# EasyEDA schematic ECUs.json

## Sheets
1 power: TITLE: Power; REV: 1.0; Date: 2020-06-11; Sheet: 1/1; Company: Your Company
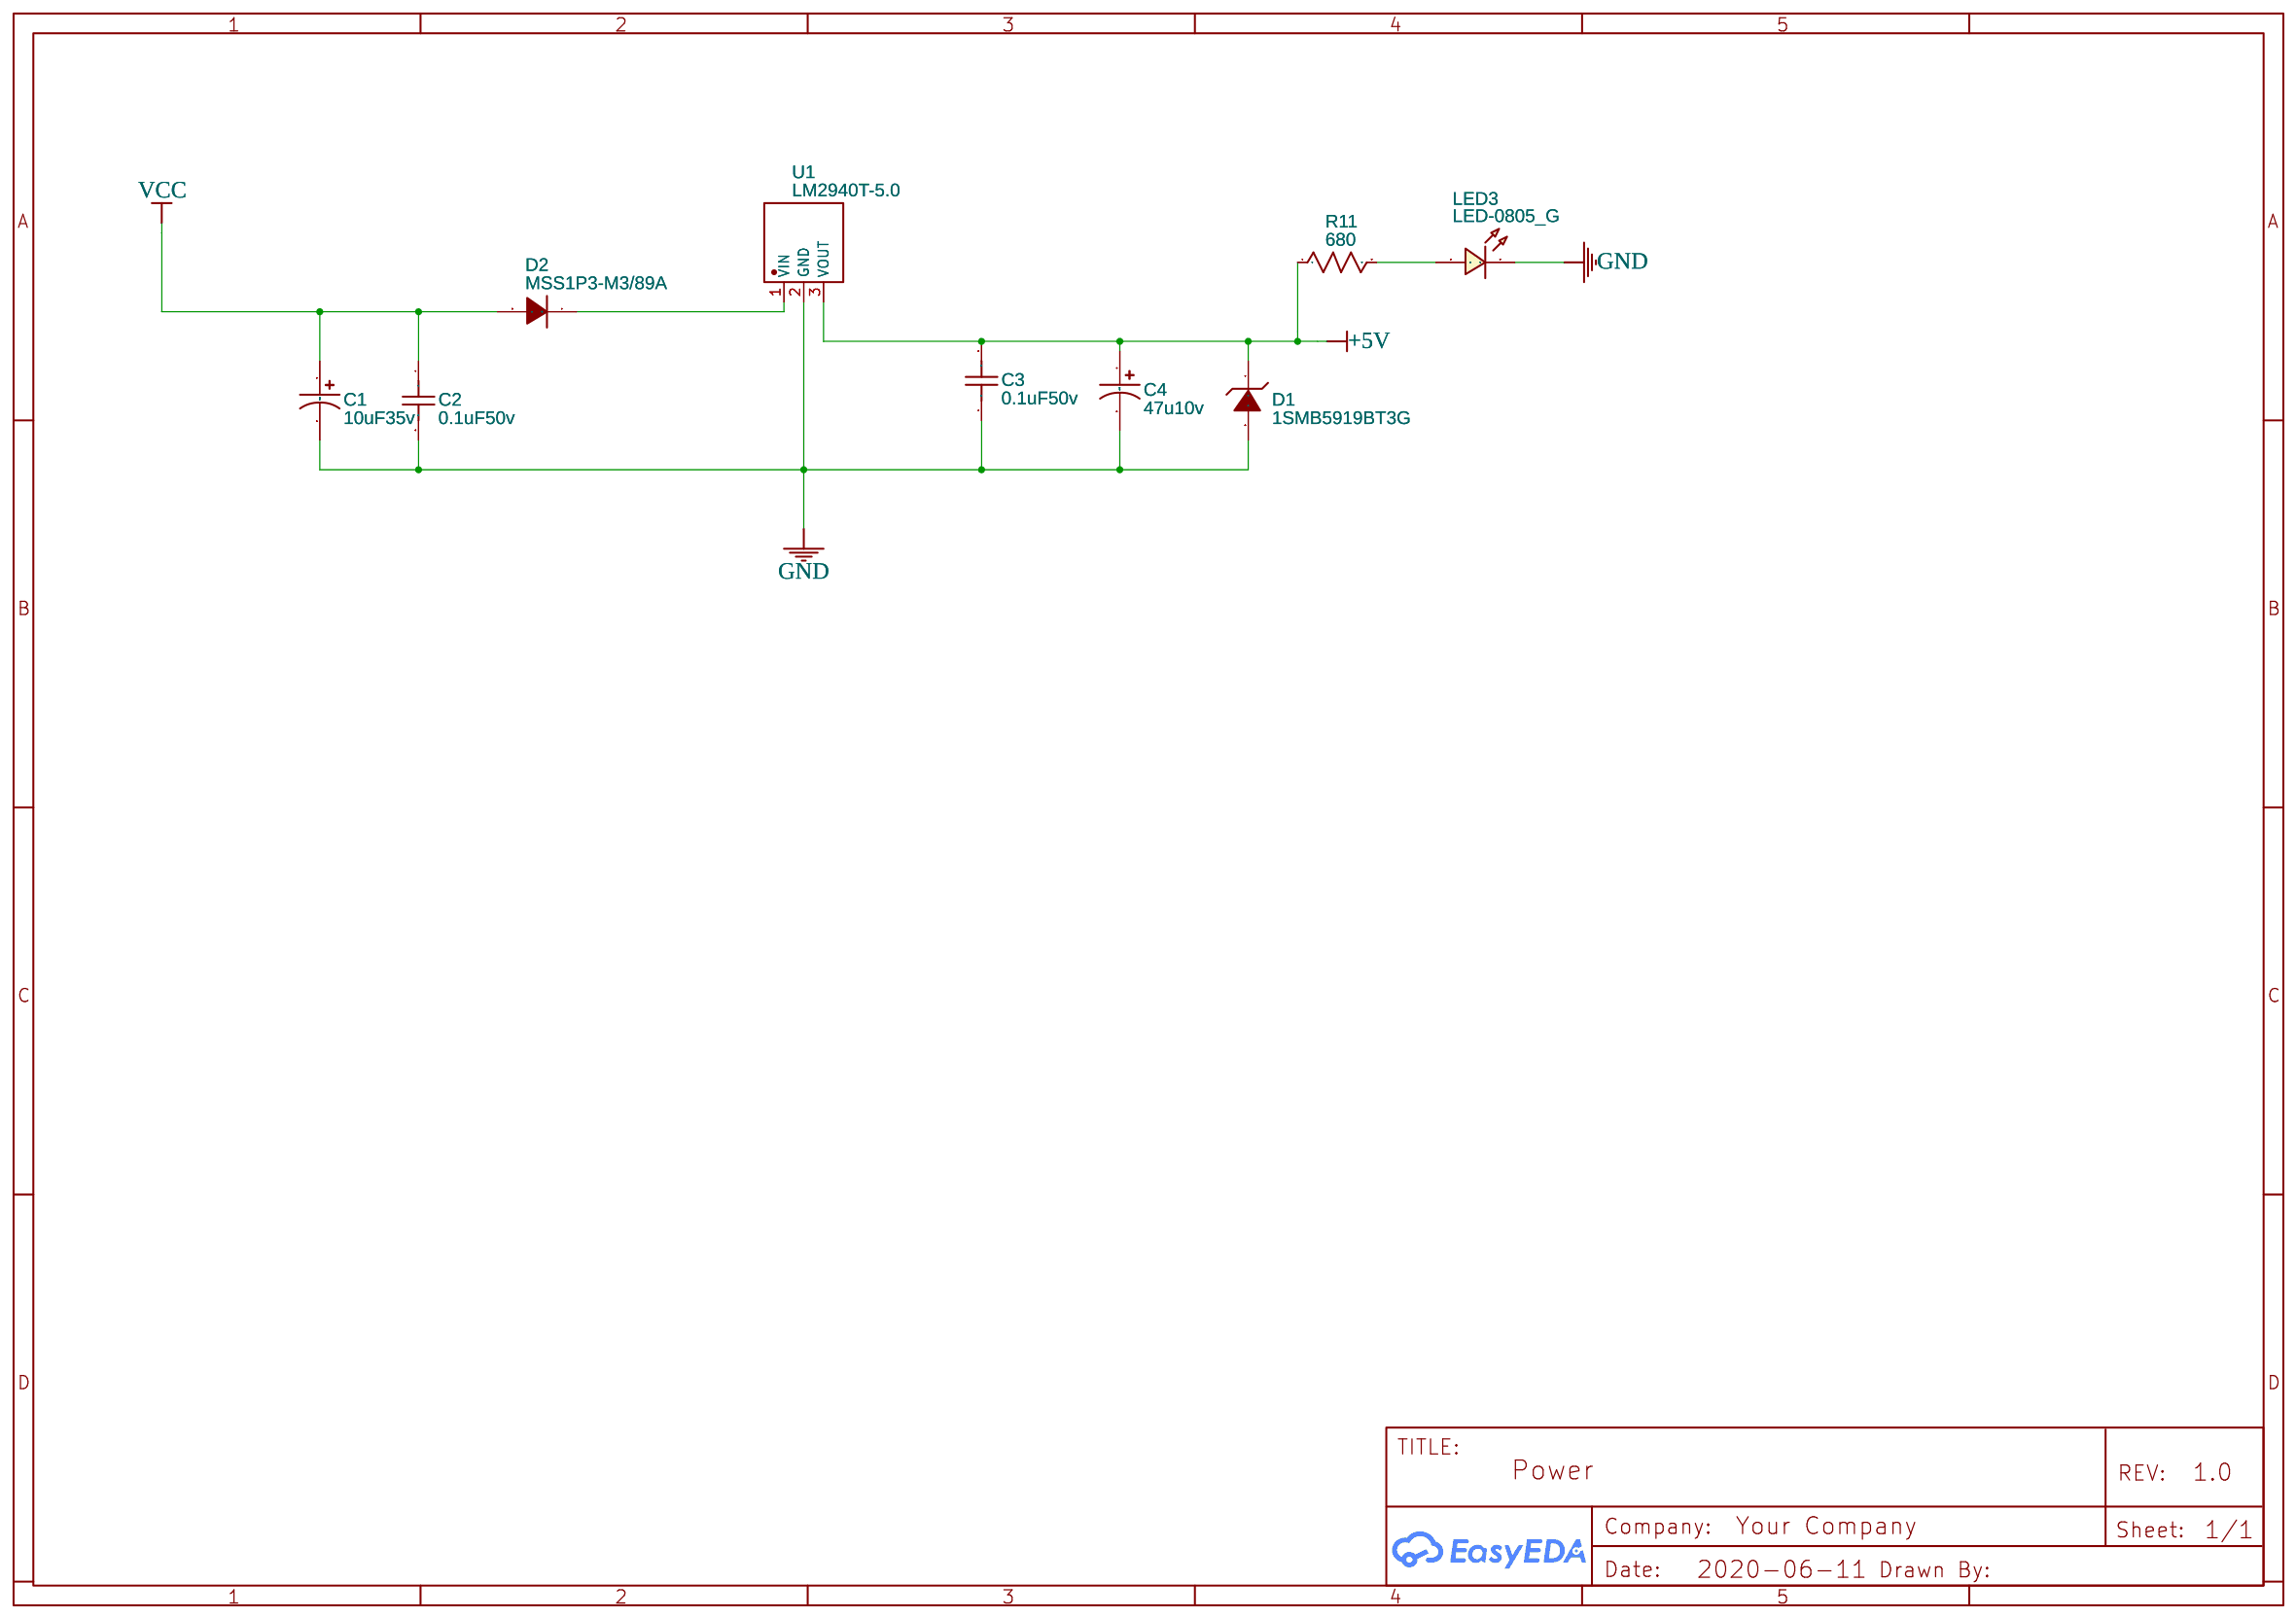
[diagram p0: power]
2 INJ: TITLE: injector
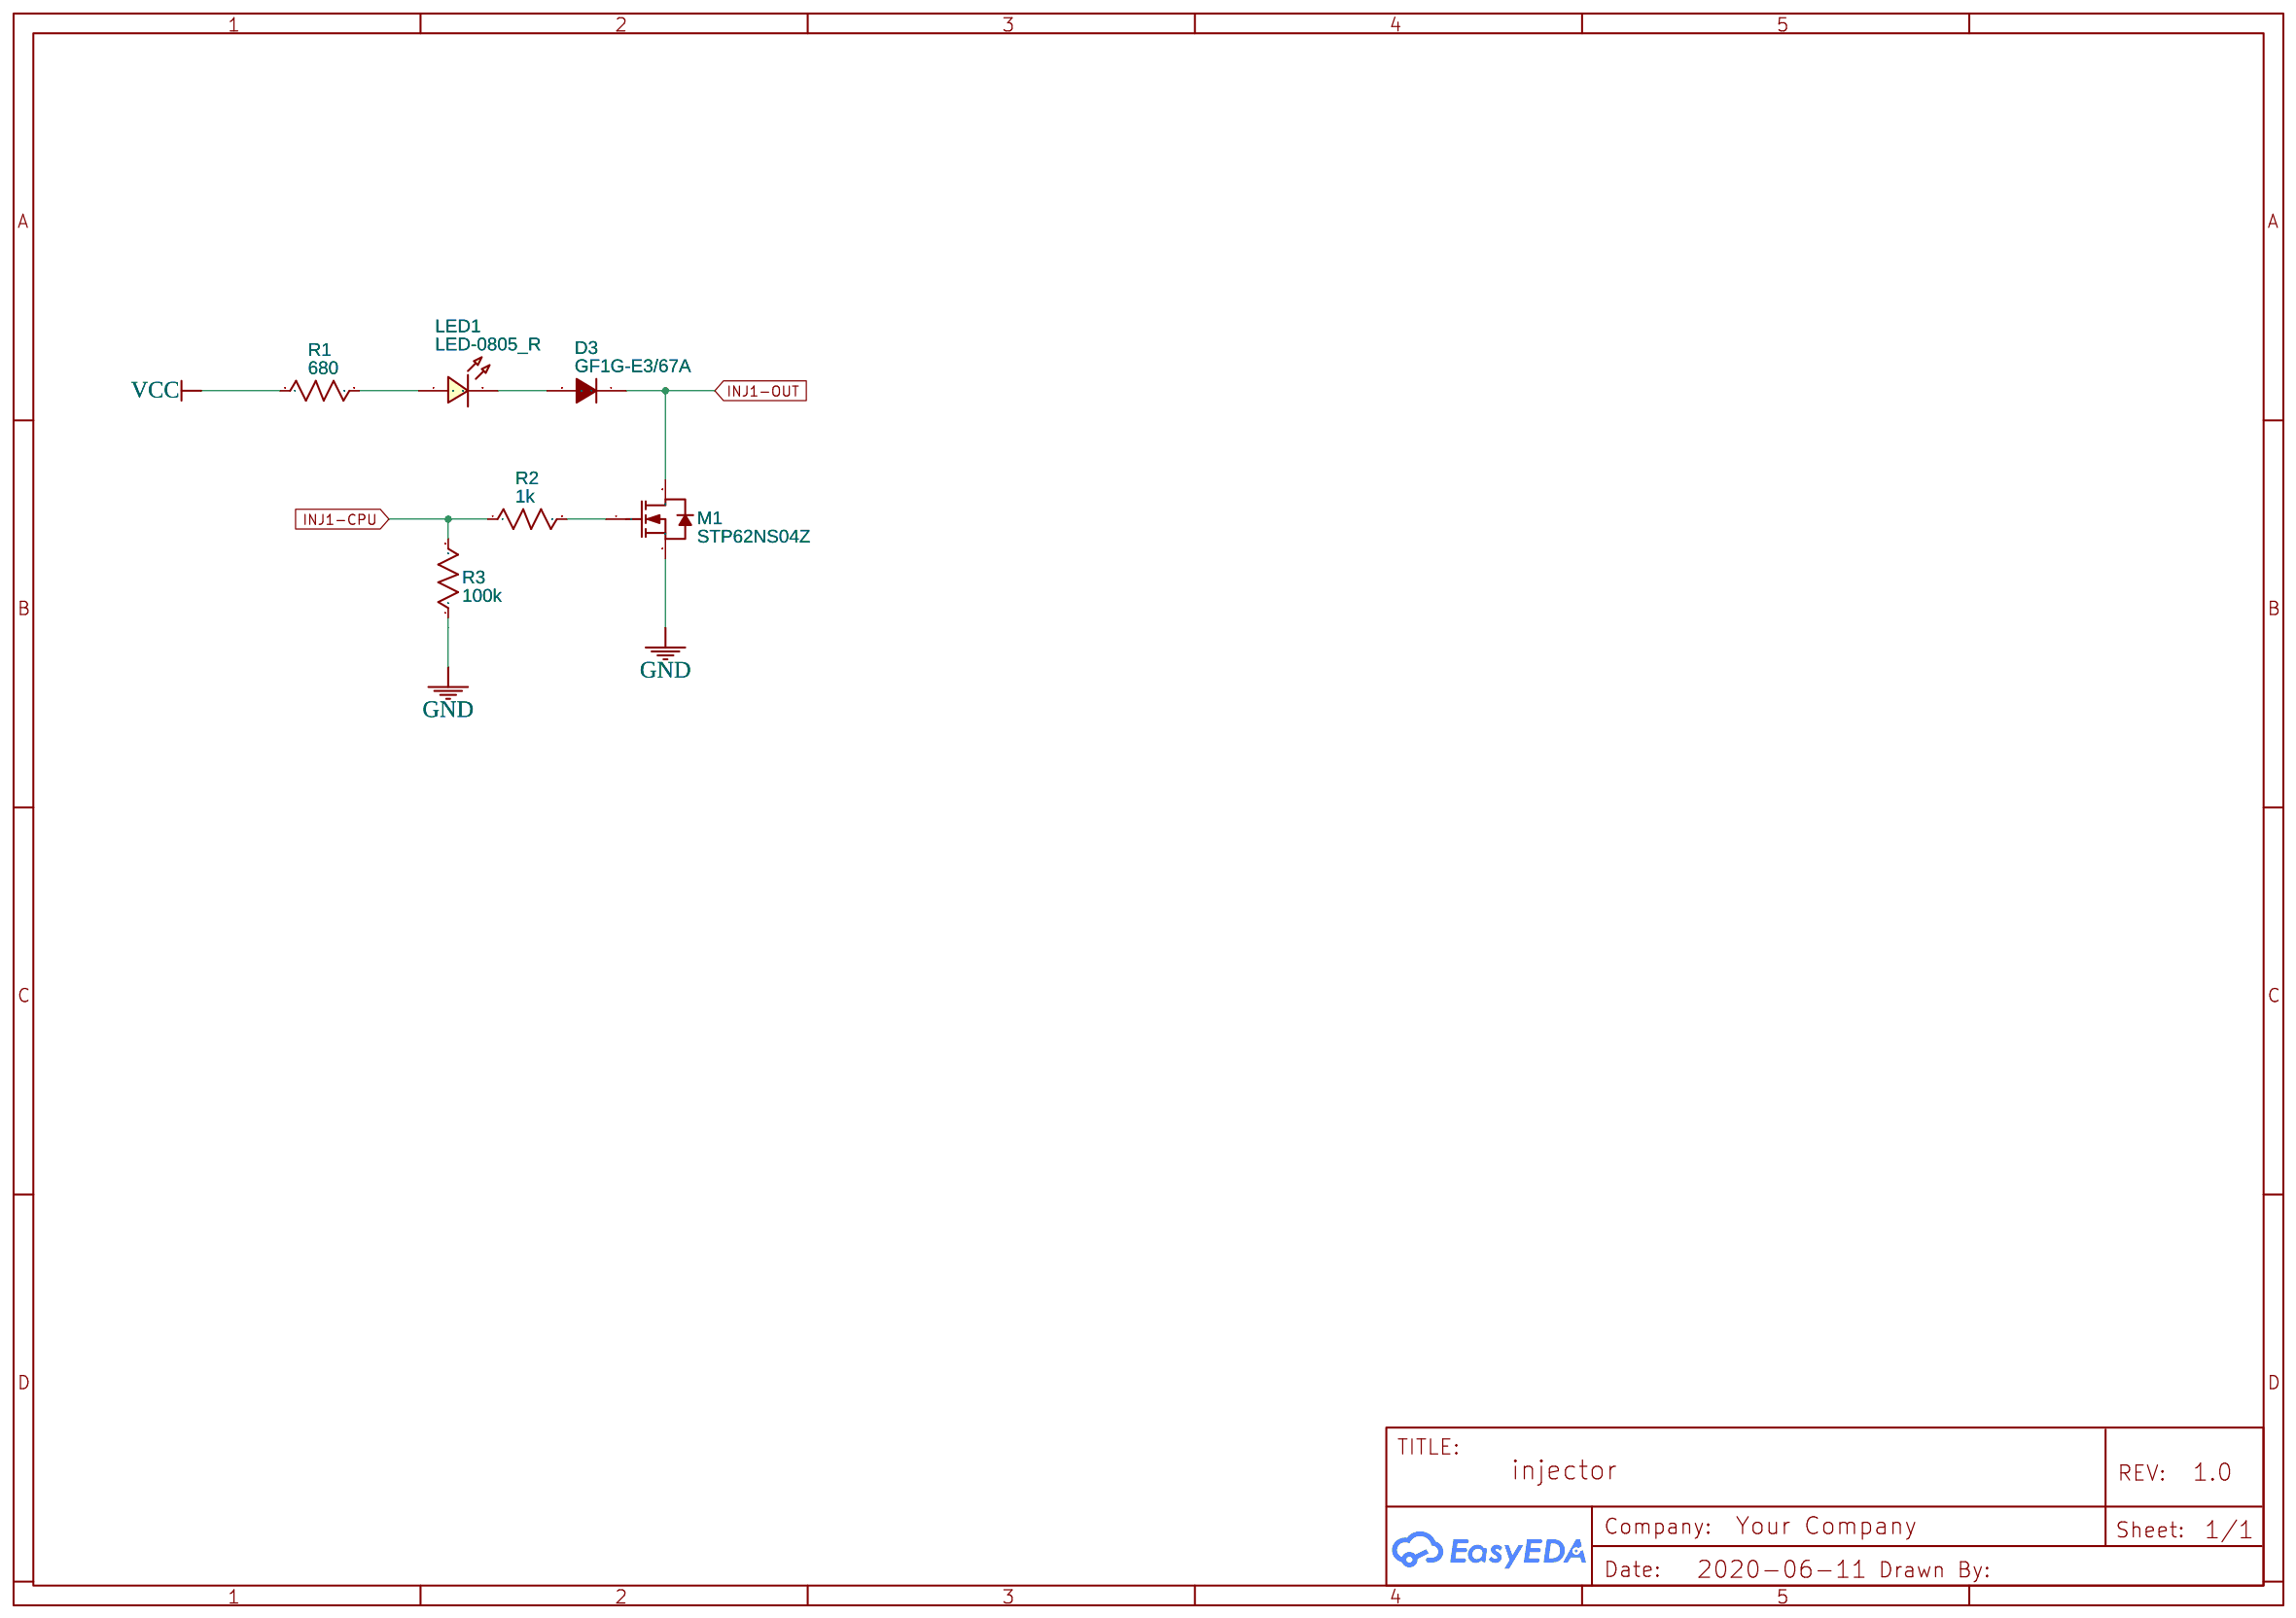
[diagram p1: INJ]
3 plug: TITLE: injector
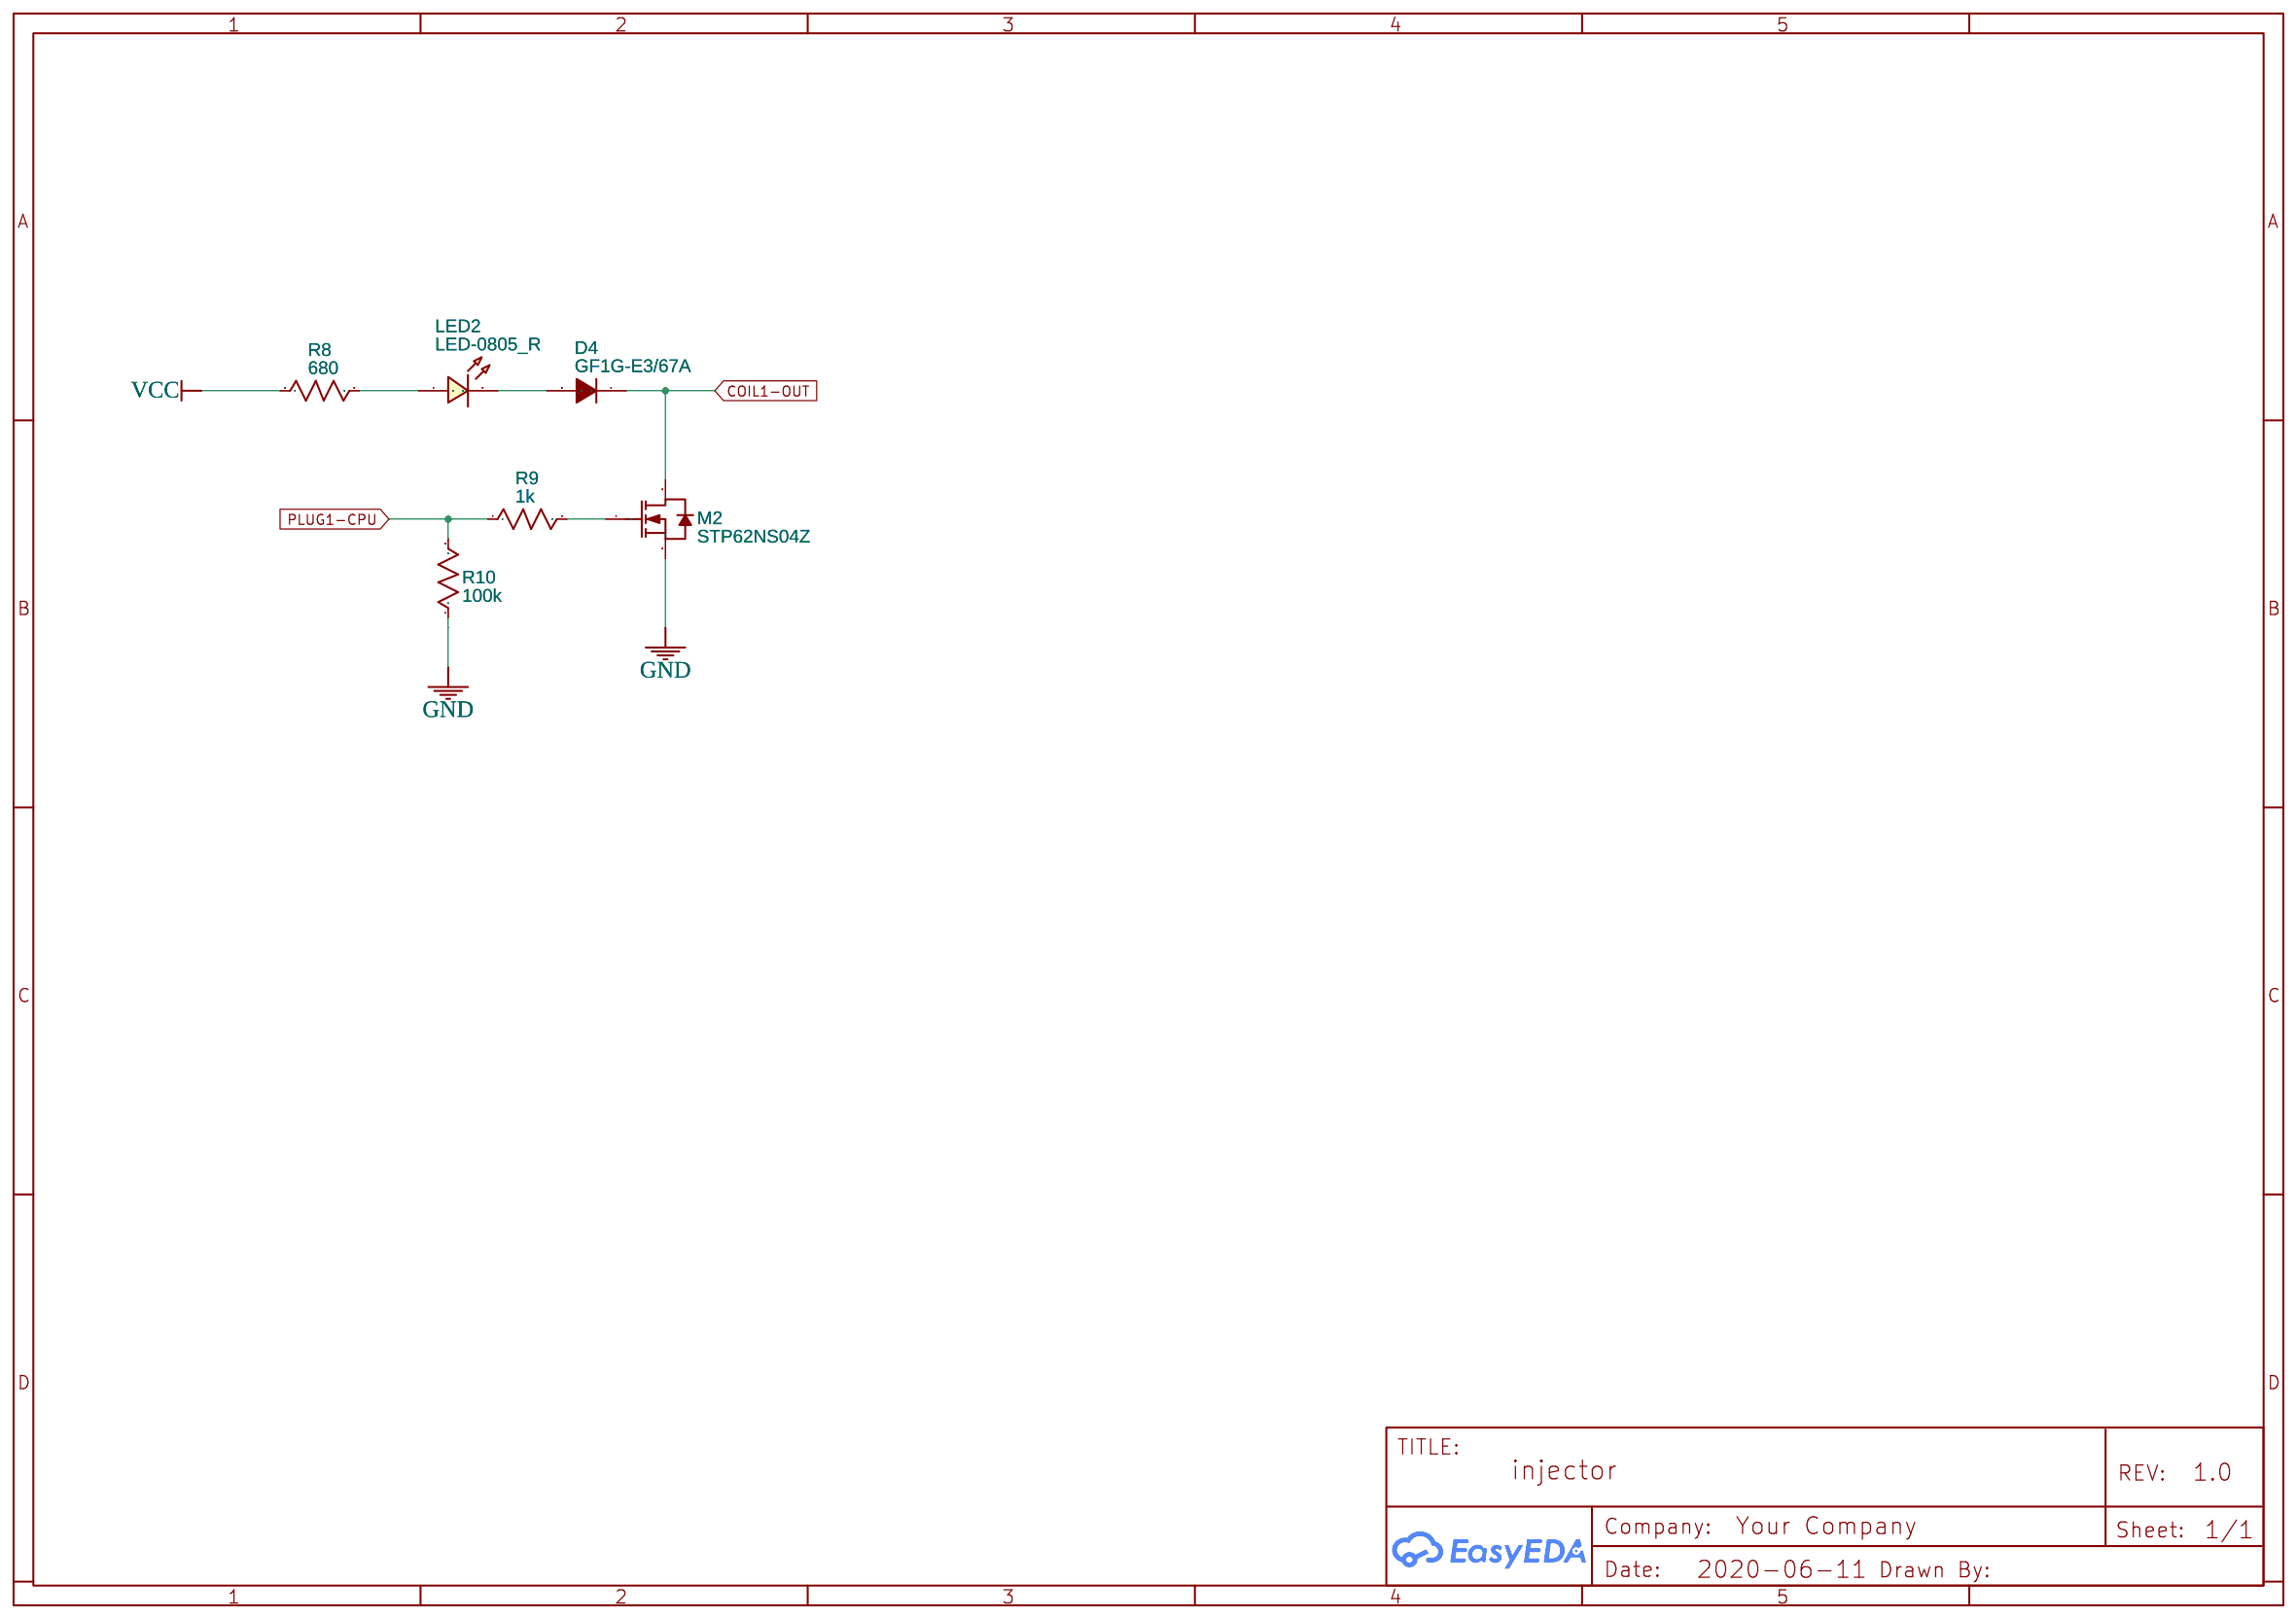
[diagram p2: plug]
4 Batt: TITLE: Battery Reference Voltage
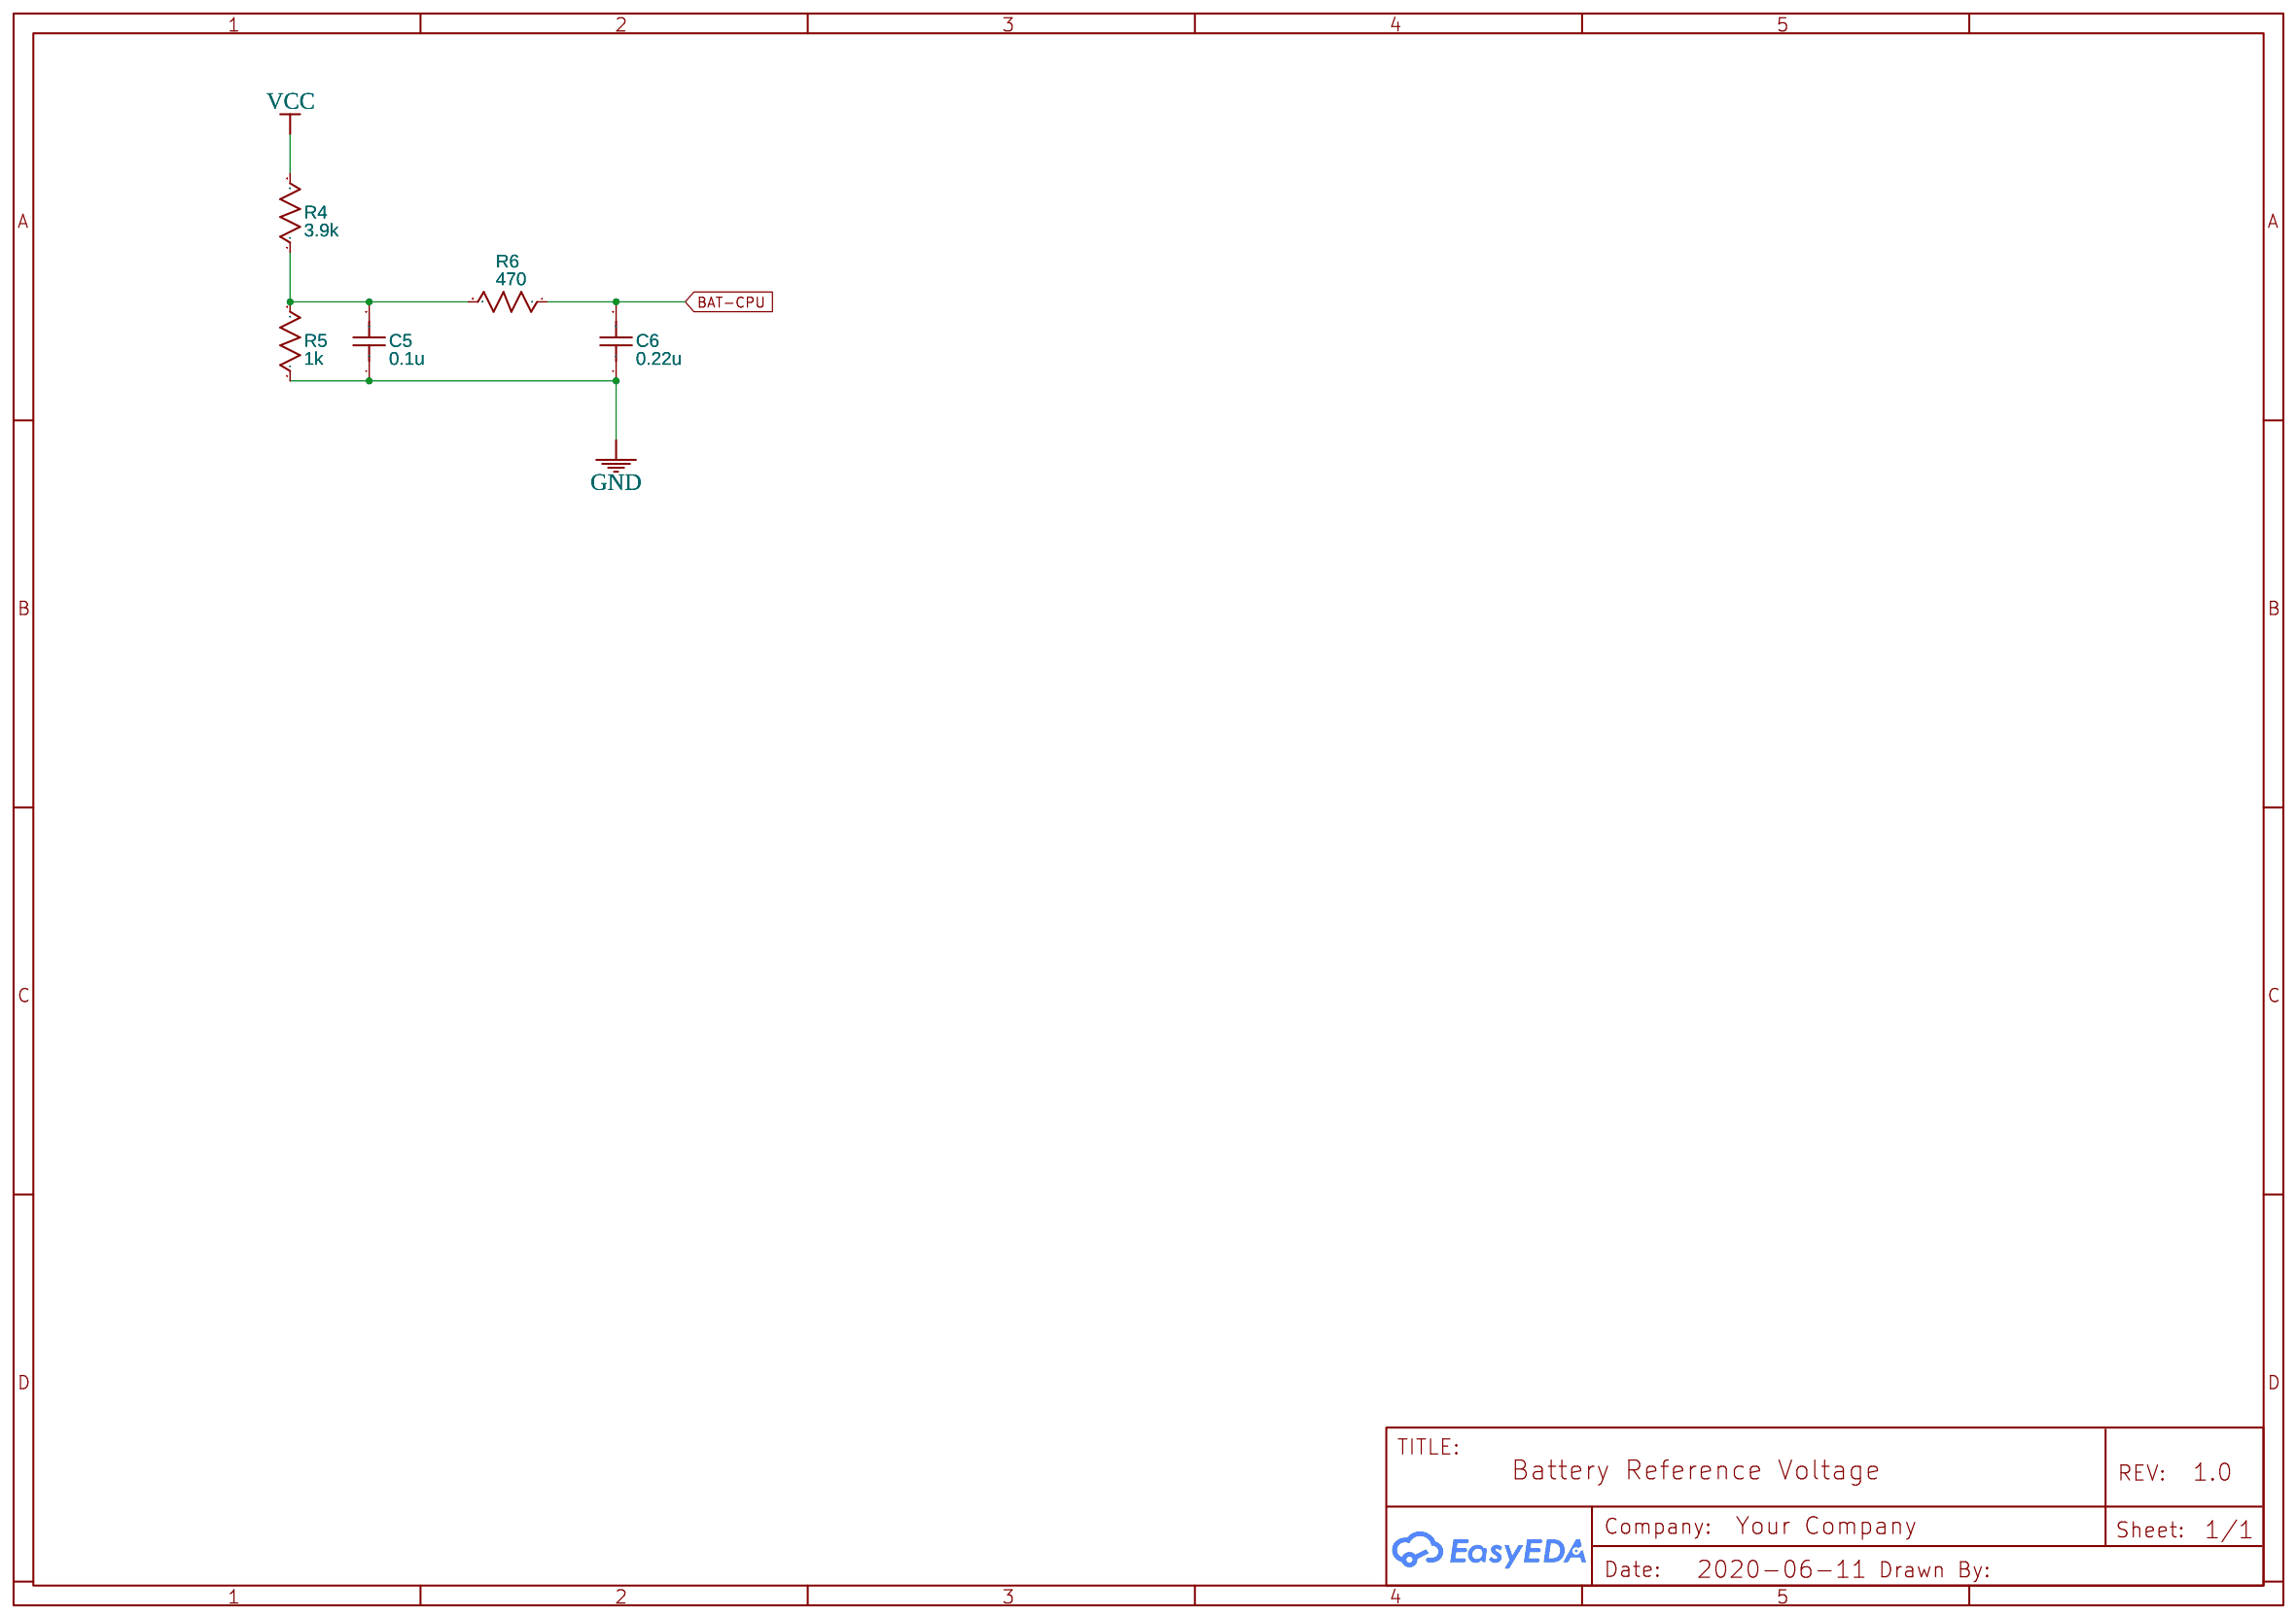
[diagram p3: Batt]
5 O2: TITLE: O2
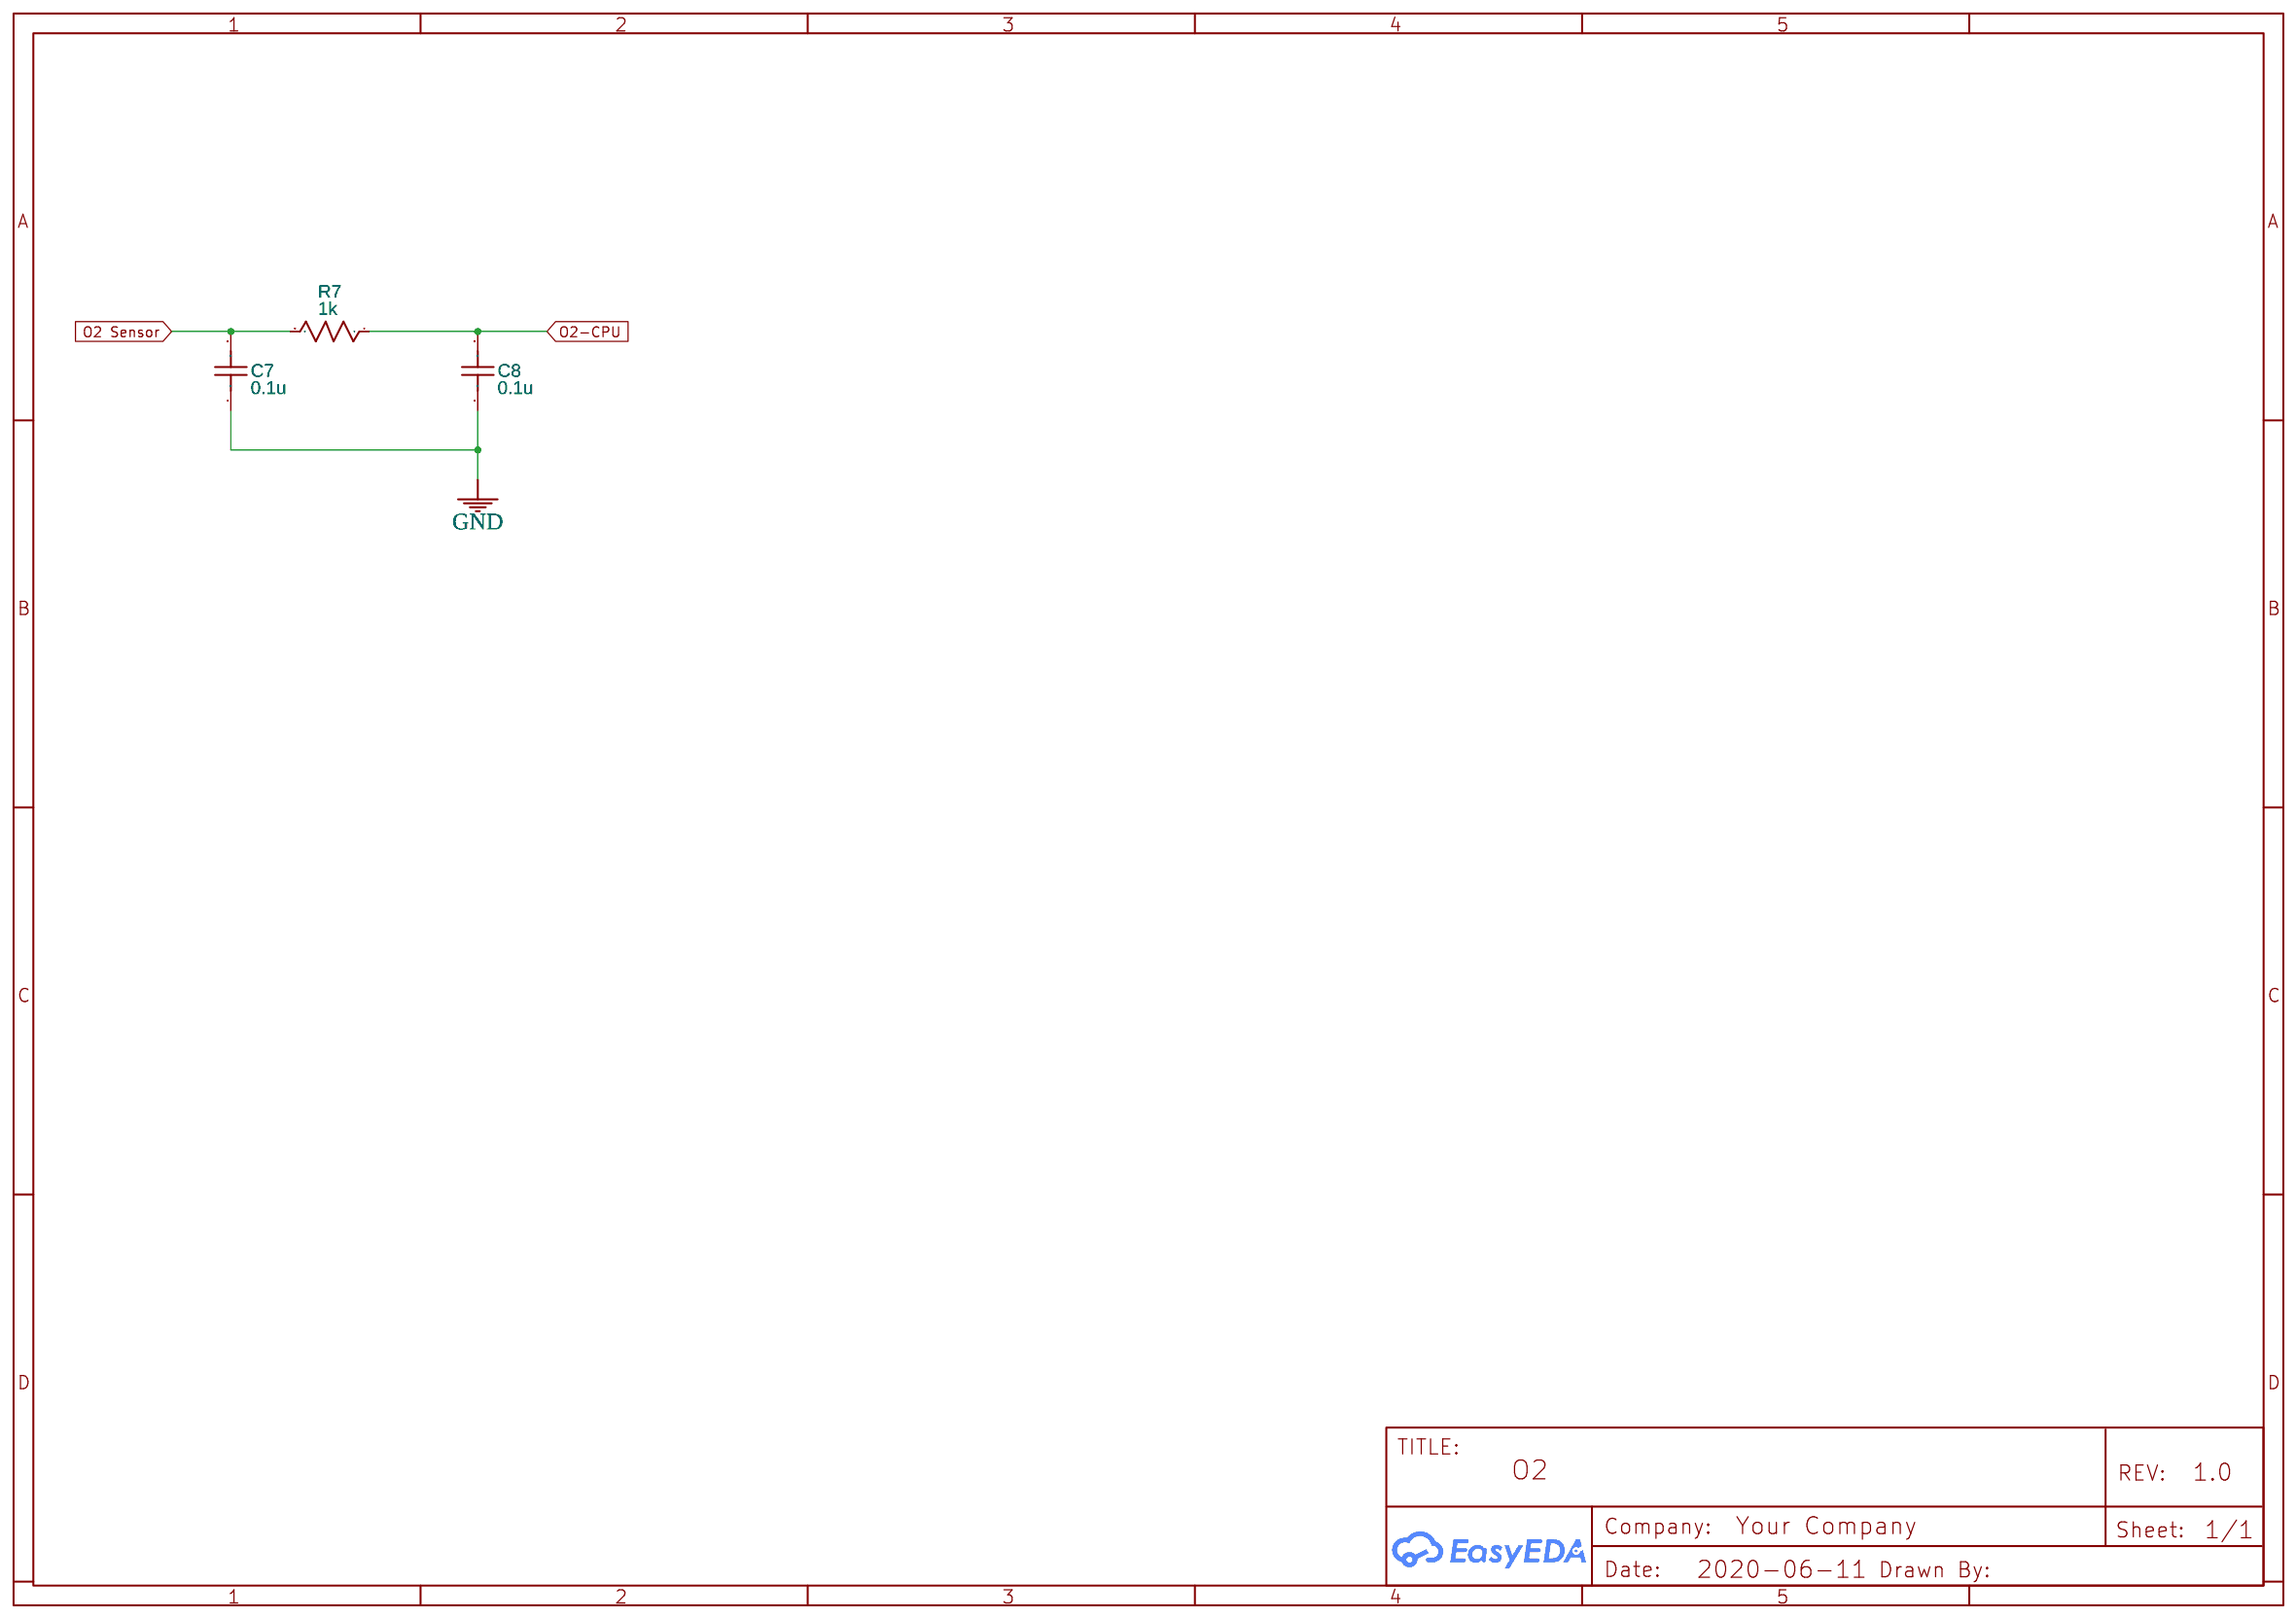
[diagram p4: O2]
6 AIC: TITLE: Air inlet
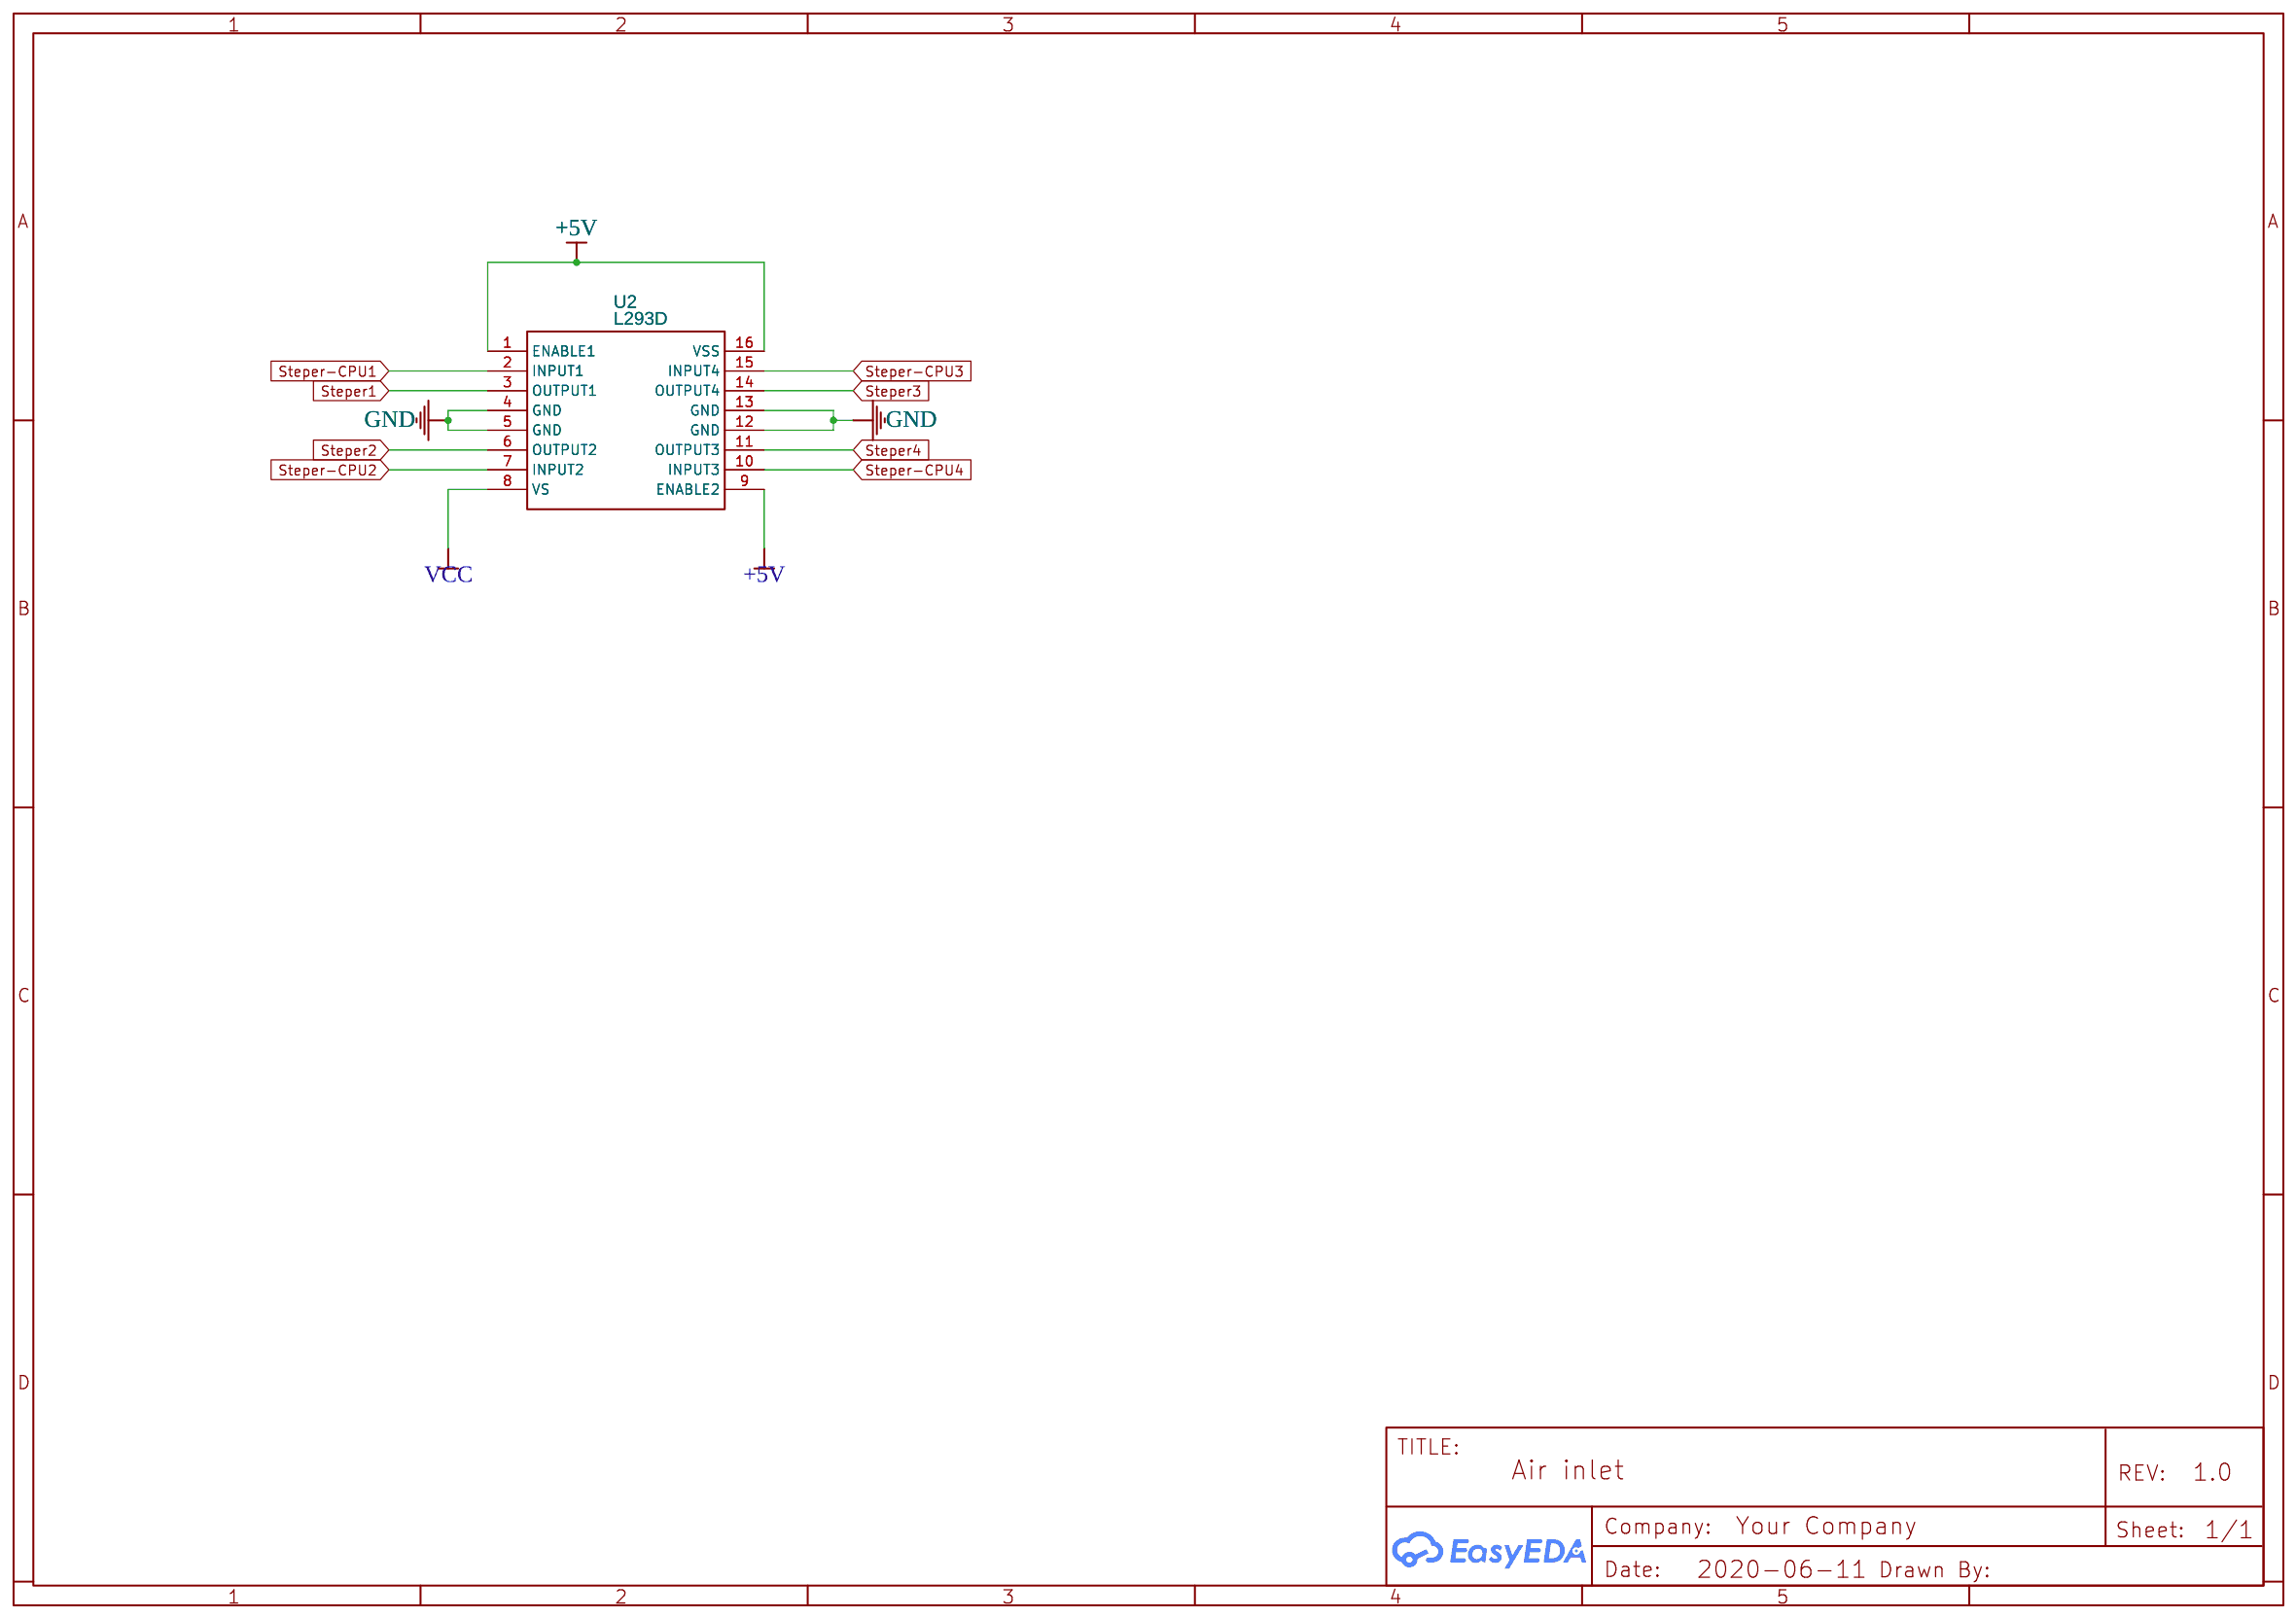
[diagram p5: AIC]
7 CPU: TITLE: CPU
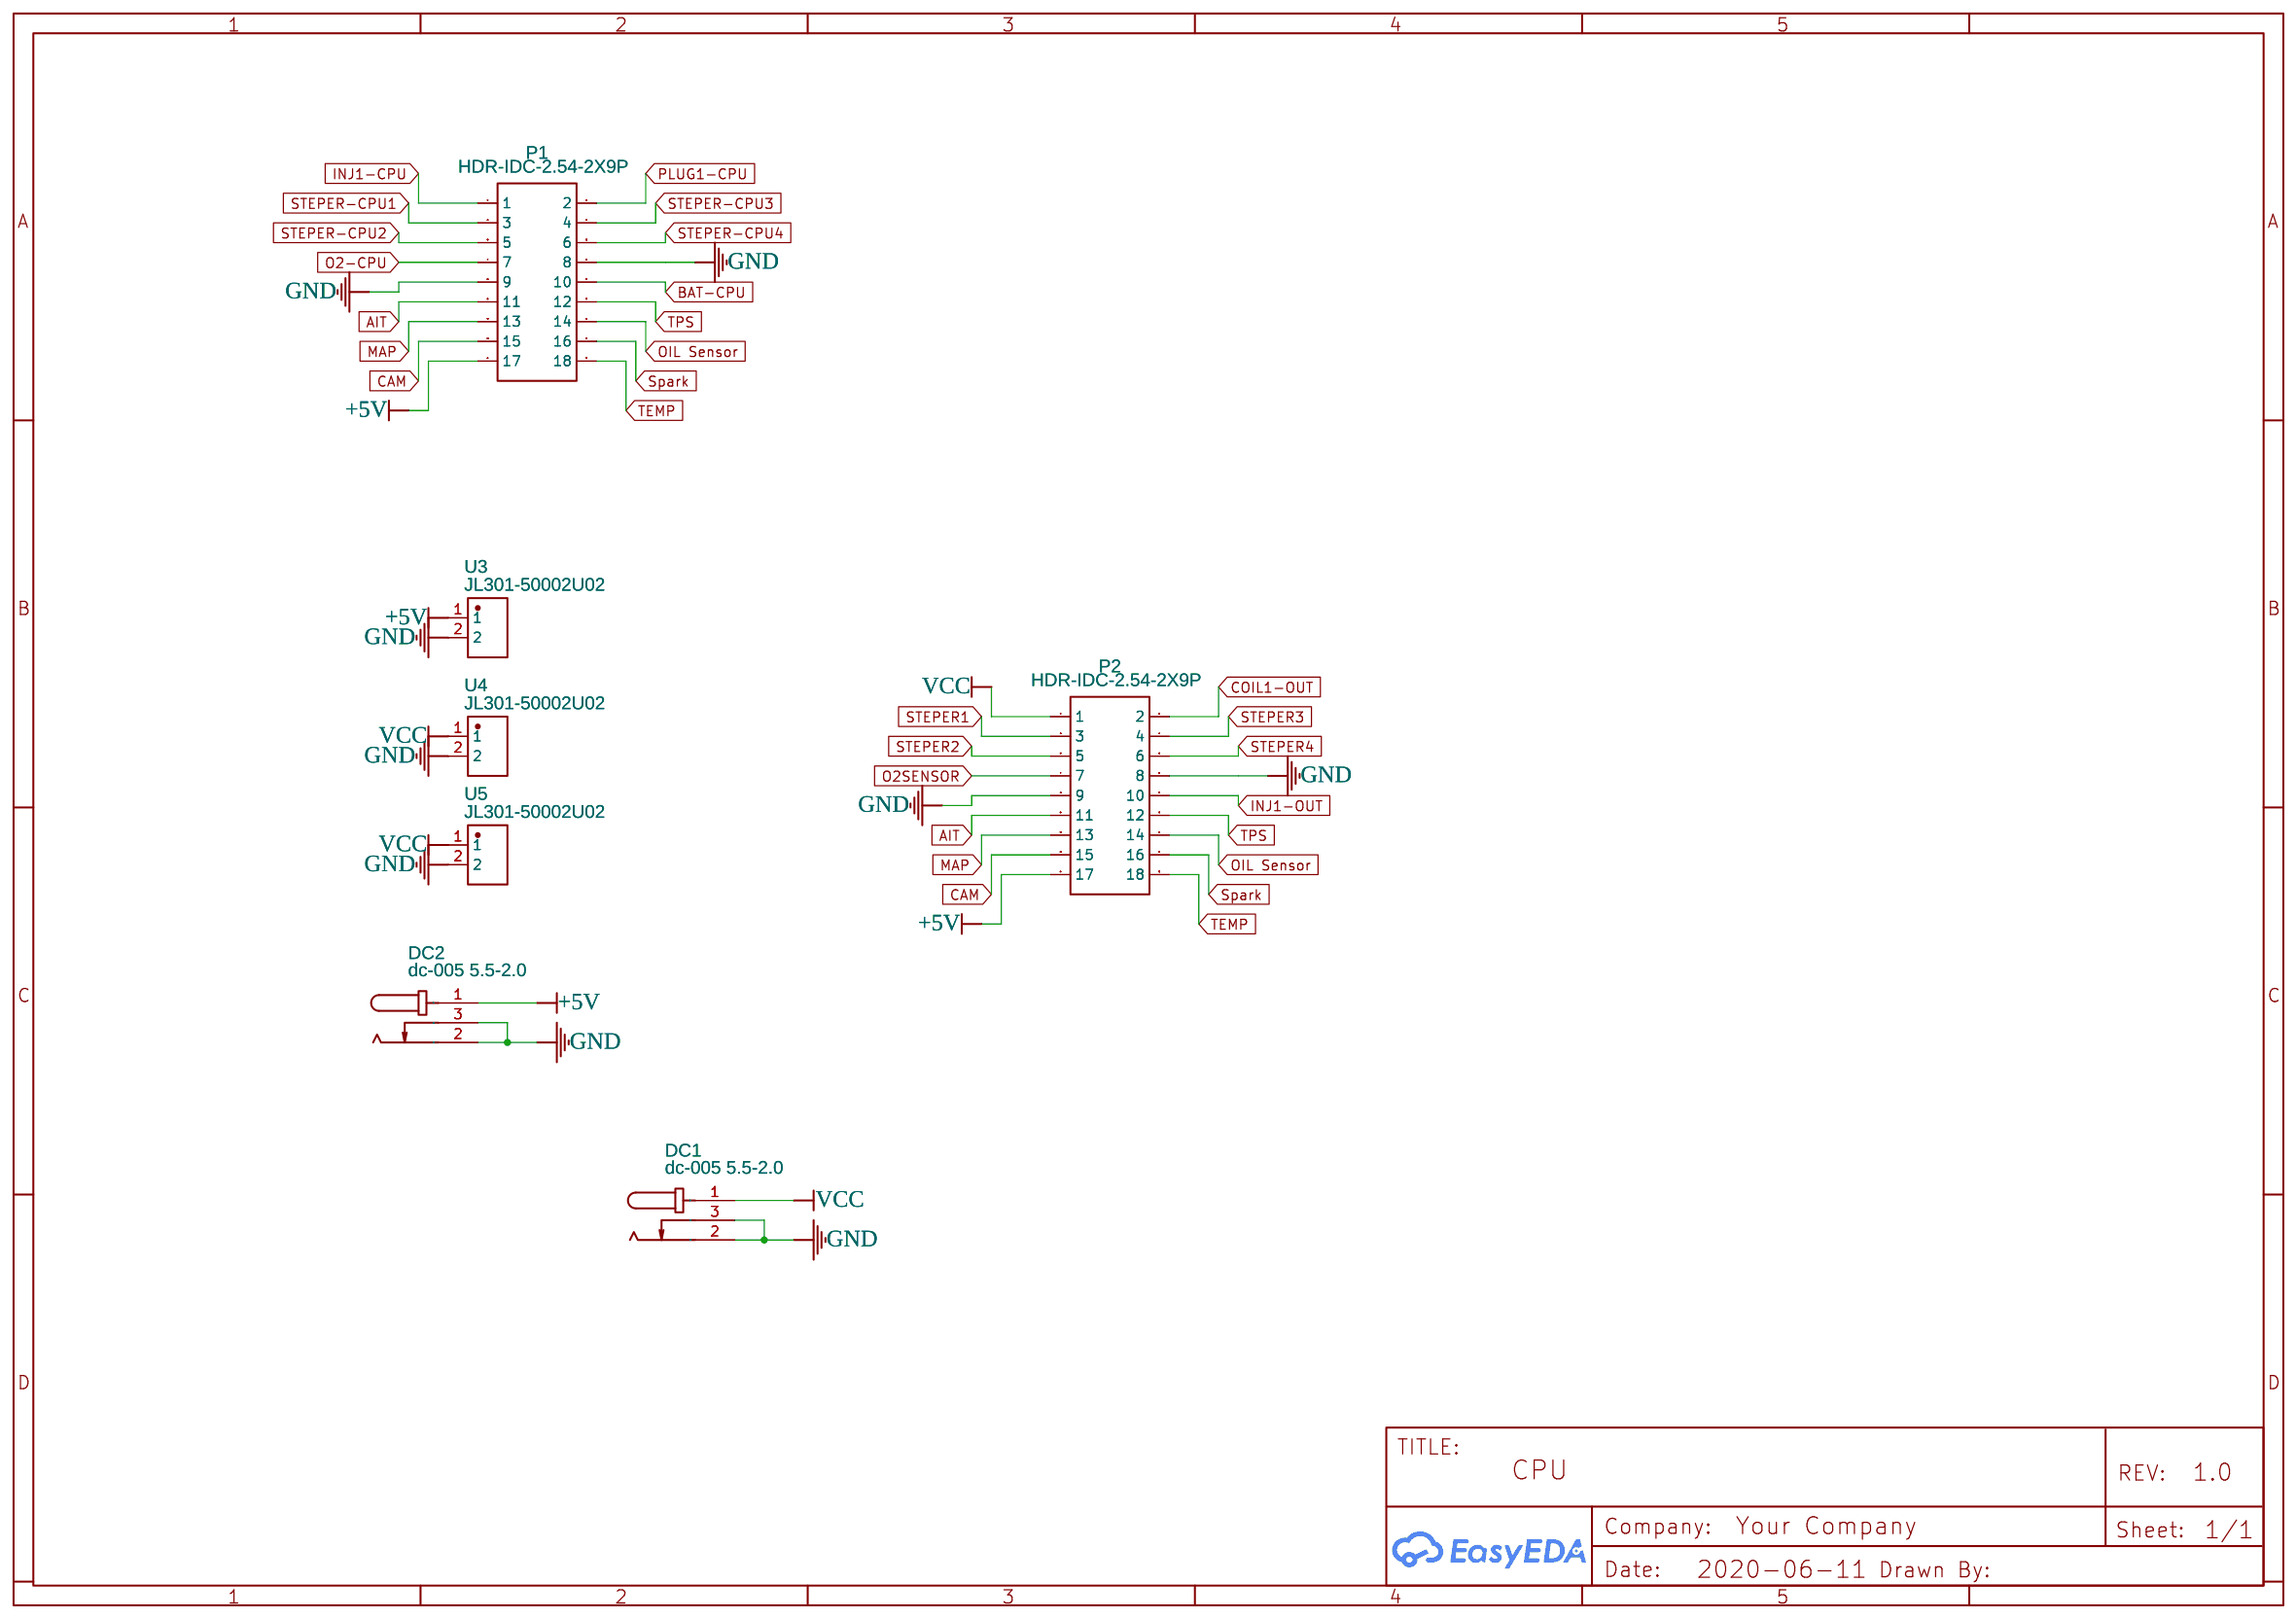
[diagram p6: CPU]

## Parts
sheet AIC
U2  L293D  [DIP-16_L20.0-W6.4-P2.54-LS7.6-BL]
sheet Batt
C5  0.1u  [C1206]
C6  0.22u  [C1206]
R4  3.9k  [R1206]
R5  1k  [R1206]
R6  470  [R1206]
sheet CPU
DC1  dc-005 5.5-2.0  [DC-IN-TH_DC005]
DC2  dc-005 5.5-2.0  [DC-IN-TH_DC005]
P1  HDR-IDC-2.54-2X9P  [IDC-TH_18P-P2.54-V-R2-C9-S2.54]
P2  HDR-IDC-2.54-2X9P  [IDC-TH_18P-P2.54-V-R2-C9-S2.54]
U3  JL301-50002U02  [CONN-TH_2P-P2.54_JL301-50002U02]
U4  JL301-50002U02  [CONN-TH_2P-P2.54_JL301-50002U02]
U5  JL301-50002U02  [CONN-TH_2P-P2.54_JL301-50002U02]
sheet INJ
D3  GF1G-E3/67A  [DO-214BA_L4.8-W2.9-LS5.3-RD]
LED1  LED-0805_R  [LED0805_RED]
M1  STP62NS04Z  [STP62NS04Z_HORIZ_HAND_SOLDER]
R1  680  [R1206]
R2  1k  [R1206]
R3  100k  [R1206]
sheet O2
C7  0.1u  [C1206]
C8  0.1u  [C1206]
R7  1k  [R1206]
sheet plug
D4  GF1G-E3/67A  [DO-214BA_L4.8-W2.9-LS5.3-RD]
LED2  LED-0805_R  [LED0805_RED]
M2  STP62NS04Z  [STP62NS04Z_HORIZ_HAND_SOLDER]
R8  680  [R1206]
R9  1k  [R1206]
R10  100k  [R1206]
sheet power
C1  10uF35v  [CASE-C_6032]
C2  0.1uF50v  [C1210]
C3  0.1uF50v  [C1210]
C4  47u10v  [CASE-B_3528]
D1  1SMB5919BT3G  [SMB_L4.6-W3.6-LS5.3-RD]
D2  MSS1P3-M3/89A  [MICROSMP_L2.2-W1.3-LS2.5-RD]
LED3  LED-0805_G  [LED0805_GREEN]
R11  680  [R1206]
U1  LM2940T-5.0  [TO-220-3_L10.0-W4.5-P2.54-L]

## Library data of the parts
U2 = L293D: Contributor: pitreluc; Supplier: LCSC; Manufacturer: STMicroelectronics; image: //image.lceda.cn/szlcsc/C12340.jpg; Supplier Part: C12340
C5 C7 C8 = C_1206_US: Supplier Part: 80-T491A104M050AT; Supplier: Mouser; Contributor: LCEDA_Lib; Manufacturer Part: T491A104M050AT; Manufacturer: KEMET
C6 = C_1206_US: Supplier Part: 581-TPSA224K050R7000; Supplier: Mouser; Contributor: LCEDA_Lib; Manufacturer Part: TPSA224K050R7000; Manufacturer: AVX
R4 = R_1206_US: Supplier Part: C137280; Supplier: LCSC; Contributor: LCEDA_Lib; Manufacturer Part: RC1206FR-073R9L; Manufacturer: YAGEO
R2 R5 R7 R9 = R_1206_US: Supplier Part: C131398; Supplier: LCSC; Contributor: LCEDA_Lib; Manufacturer Part: RC1206FR-071KL; Manufacturer: YAGEO
R6 = R_1206_US: Supplier Part: C114945; Supplier: LCSC; Contributor: LCEDA_Lib; Manufacturer Part: RC1206FR-07470RL; Manufacturer: YAGEO
DC1 DC2 = dc-005 5.5-2.0: Supplier: LCSC; Supplier Part: C132516; Manufacturer: Shenzhen Cankemeng; Contributor: LCSC
P1 P2 = HDR-IDC-2.54-2X9P: Supplier: LCSC; Manufacturer: BOOMELE; Manufacturer Part: 2X9 2.54mm IDC Box; image: //image.lceda.cn/szlcsc/C11216.jpg; Supplier Part: C11216
U3-U5 = JL301-50002U02: Supplier: LCSC; Supplier Part: C395214; Manufacturer: JILN; Contributor: LCSC
D3 D4 = GF1G-E3/67A: Supplier: LCSC; Manufacturer: VISHAY; Contributor: LCSC; Supplier Part: C145458; LCSC Assembly: Yes; SMT Type: Extend
LED1 LED2 = LED-0805_R: Manufacturer: EVERLIGHT(台湾亿光); Manufacturer Part: 17-21SURC/S530-A3/TR8; Supplier Part: C72037; Contributor: LCEDA_Lib
M1 M2 = STP62NS04Z: Supplier: RS-Online; Manufacturer: ST; Supplier Part: 761-0152; Contributor: Andy Fierman
R1 R8 R11 = R_1206_US: Supplier Part: 603-RT1206FRE07680RL; Supplier: Mouser; Contributor: LCEDA_Lib; Manufacturer Part: RT1206FRE07680RL; Manufacturer: Yageo
R3 R10 = R_1206_US: Supplier Part: C137393; Supplier: LCSC; Contributor: LCEDA_Lib; Manufacturer Part: RC1206FR-07100KL; Manufacturer: YAGEO
C1 = C_Tan_SMD_A_US: Supplier Part: 80-T491C106K035; Supplier: Mouser; Contributor: LCEDA_Lib; Manufacturer Part: T491C106K035AT; Manufacturer: KEMET
C2 = C_1206_US: Supplier Part: 77-VJ1210Y104MXAAT; Supplier: Mouser; Contributor: LCEDA_Lib; Manufacturer Part: VJ1210Y104MXAAT; Package Display: No; Manufacturer: Vishay / Vitramon
C3 = C_1206_US: Supplier Part: 77-VJ1210Y104MXAAT; Supplier: Mouser; Contributor: LCEDA_Lib; Manufacturer Part: VJ1210Y104MXAAT; Manufacturer: Vishay / Vitramon
C4 = C_Tan_SMD_B_US: Supplier Part: 80-T491B476K006; Supplier: Mouser; Contributor: LCEDA_Lib; Manufacturer Part: T491B476K006AT; Manufacturer: KEMET
D1 = 1SMB5919BT3G: Supplier: LCSC; Supplier Part: C70260; Manufacturer: ON Semicon; Contributor: LCSC; LCSC Assembly: Yes; SMT Type: Extend
D2 = MSS1P3-M3/89A: Supplier: LCSC; Supplier Part: C111315; Manufacturer: Vishay Intertech; Contributor: LCSC
LED3 = LED-0805_G: Manufacturer: 国星光电; Manufacturer Part: NCD0805G1; Supplier Part: C84260; Contributor: LCEDA_Lib
U1 = LM2940T-5.0: Supplier: LCSC; Supplier Part: C434573; Manufacturer: HGSEMI; Contributor: LCSC

## Nets
+5V: C3.2 C4.1 D1.1(K) DC2.1 P1.17 P2.17 R11.1 U1.3(VOUT) U2.1(ENABLE1) U2.9(ENABLE2) U2.16(VSS) U3.1
GND: C1.2 C2.2 C3.1 C4.2 C5.1 C6.1 C7.1 C8.1 D1.2(A) DC1.2 DC1.3 DC2.2 DC2.3 LED3.2 M1.3(S) M2.3(S) P1.8 P1.9 P2.8 P2.9 R3.1 R5.1 R10.1 U1.2(GND) U2.4(GND) U2.5(GND) U2.12(GND) U2.13(GND) U3.2 U4.2 U5.2
VCC: C1.1 C2.1 D2.2(A) DC1.1 P2.1 R1.1 R4.2 R8.1 U2.8(VS) U4.1 U5.1
AIT: P1.11 P2.11
BAT-CPU: C6.2 P1.10 R6.1
CAM: P1.15 P2.15
COIL1-OUT: D4.1(K) M2.2(D) P2.2
INJ1-CPU: P1.1 R2.1 R3.2
INJ1-OUT: D3.1(K) M1.2(D) P2.10
MAP: P1.13 P2.13
O2 Sensor: C7.2 R7.2
O2-CPU: C8.2 P1.7 R7.1
O2SENSOR: P2.7
OIL Sensor: P1.14 P2.14
PLUG1-CPU: P1.2 R9.1 R10.2
Spark: P1.16 P2.16
Steper1: U2.3(OUTPUT1)
STEPER1: P2.3
Steper2: U2.6(OUTPUT2)
STEPER2: P2.5
Steper3: U2.14(OUTPUT4)
STEPER3: P2.4
Steper4: U2.11(OUTPUT3)
STEPER4: P2.6
Steper-CPU1: U2.2(INPUT1)
STEPER-CPU1: P1.3
Steper-CPU2: U2.7(INPUT2)
STEPER-CPU2: P1.5
Steper-CPU3: U2.15(INPUT4)
STEPER-CPU3: P1.4
Steper-CPU4: U2.10(INPUT3)
STEPER-CPU4: P1.6
TEMP: P1.18 P2.18
TPS: P1.12 P2.12
Net-(C5-2): C5.2 R4.1 R5.2 R6.2
Net-(D2-1): D2.1(C) U1.1(VIN)
Net-(D3-2): D3.2(A) LED1.2
Net-(D4-2): D4.2(A) LED2.2
Net-(LED1-1): LED1.1 R1.2
Net-(LED2-1): LED2.1 R8.2
Net-(LED3-1): LED3.1 R11.2
Net-(M1-1): M1.1(G) R2.2
Net-(M2-1): M2.1(G) R9.2
